# Altium schematic sheet Prometheus.SchDoc: Prometheus
size Letter; Author: Nicholas Sorensen, Tharun Suresh, Erik Halliwell, Stefan Damkjar, and Duncan Elliott; CompanyName: AlbertaSat; Organization: Altium Limited; Revision: 4.1; SheetNumber: 1; SheetTotal: 4; CopyrightYear: 2019
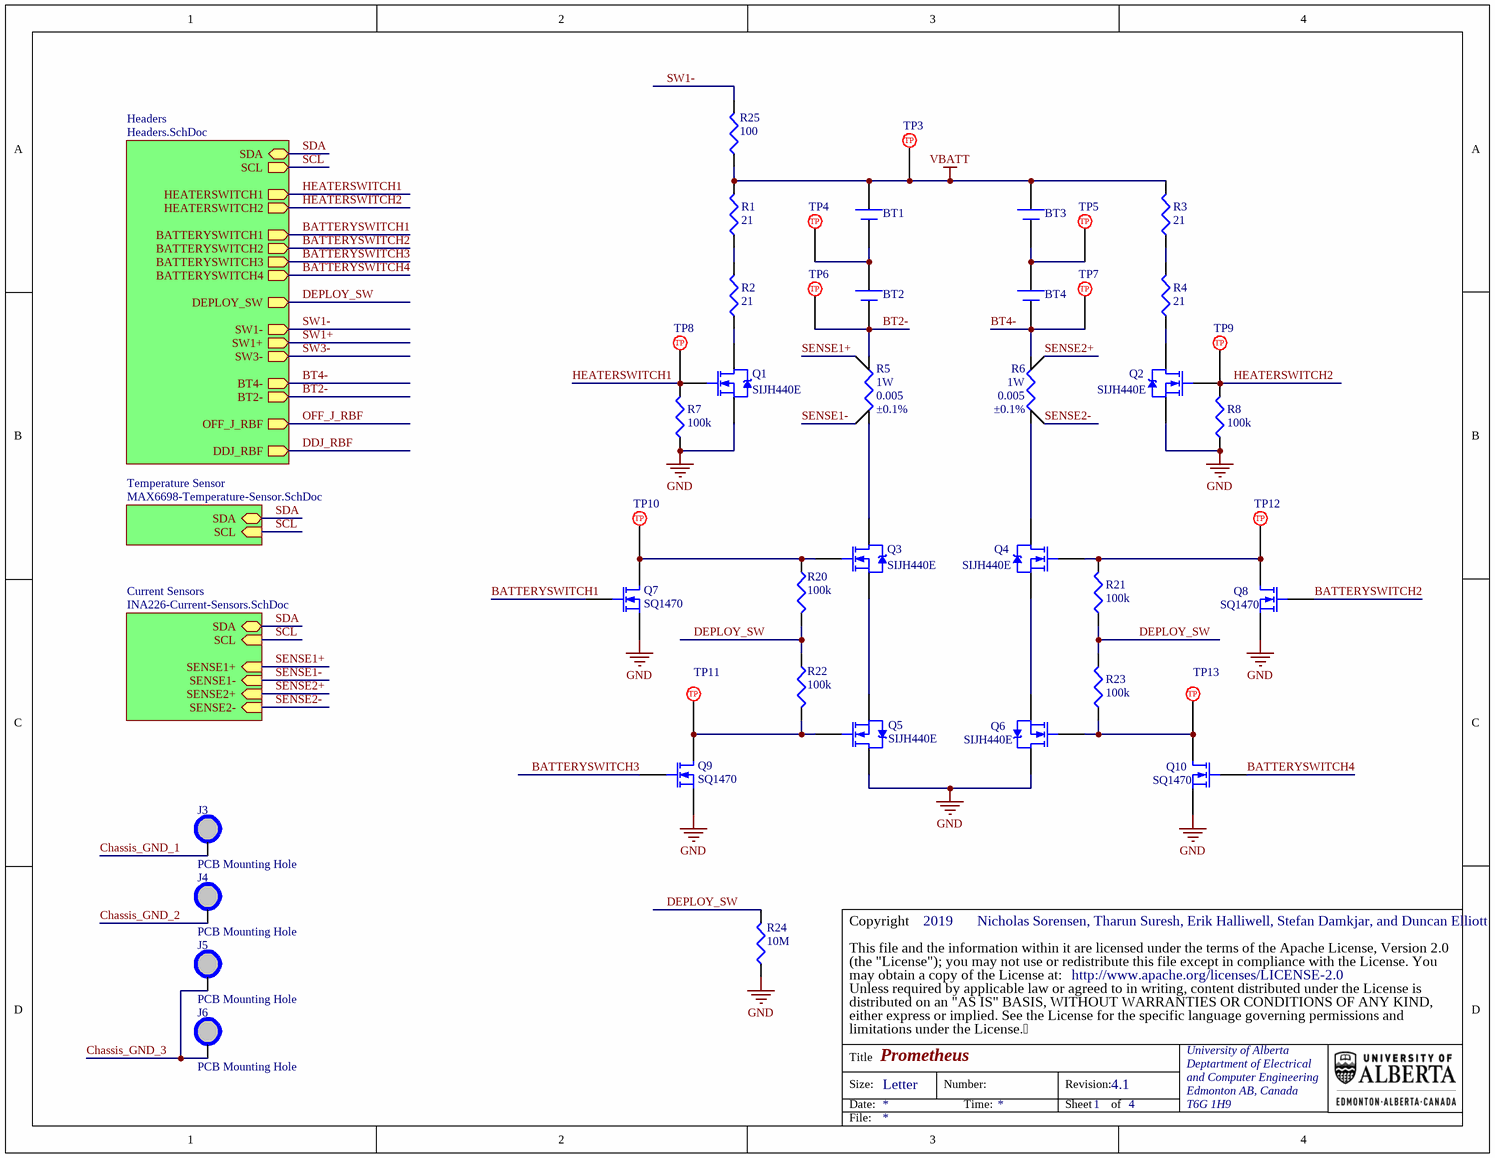
[diagram p0: Prometheus.SchDoc]

## Parts
BT1  NCR18650PF  [ORB-PROTECTED18650]  (value not drawn)
BT2  NCR18650PF  [ORB-PROTECTED18650]  (value not drawn)
BT3  NCR18650PF  [ORB-PROTECTED18650]  (value not drawn)
BT4  NCR18650PF  [ORB-PROTECTED18650]  (value not drawn)
J3  PCB Mounting Hole  [PCB Mounting Hole]
J4  PCB Mounting Hole  [PCB Mounting Hole]
J5  PCB Mounting Hole  [PCB Mounting Hole]
J6  PCB Mounting Hole  [PCB Mounting Hole]
Q1  SIJH440E  [VSH-POWERPAK8X8L]
Q2  SIJH440E  [VSH-POWERPAK8X8L]
Q3  SIJH440E  [VSH-POWERPAK8X8L]
Q4  SIJH440E  [VSH-POWERPAK8X8L]
Q5  SIJH440E  [VSH-POWERPAK8X8L]
Q6  SIJH440E  [VSH-POWERPAK8X8L]
Q7  SQ1470  [VSH-SQ1470AEH]
Q8  SQ1470  [VSH-SQ1470AEH]
Q9  SQ1470  [VSH-SQ1470AEH]
Q10  SQ1470  [VSH-SQ1470AEH]
R1  value 21  [VSH-CPF1]  (hidden comment: Res3)
R2  value 21  [VSH-CPF1]  (hidden comment: Res3)
R3  value 21  [VSH-CPF1]  (hidden comment: Res3)
R4  value 21  [VSH-CPF1]  (hidden comment: Res3)
R5  value 0.005  Power - Rated: 1W  Tolerance: ±0.1%  [VSH-2512R4B]  (hidden comment: Res Sense)
R6  value 0.005  Power - Rated: 1W  Tolerance: ±0.1%  [VSH-2512R4B]  (hidden comment: Res Sense)
R7  value 100k  [PANA-ERJ6EN]  (hidden comment: Res3)
R8  value 100k  [PANA-ERJ6EN]  (hidden comment: Res3)
R20  value 100k  [PANA-ERJ6EN]  (hidden comment: Res3)
R21  value 100k  [PANA-ERJ6EN]  (hidden comment: Res3)
R22  value 100k  [PANA-ERJ6EN]  (hidden comment: Res3)
R23  value 100k  [PANA-ERJ6EN]  (hidden comment: Res3)
R24  value 10M  [VSH-0603MCT]  (hidden comment: Res3)
R25  value 100  [VSH-0805MCU]  (hidden comment: Res3)
TP3  5017  [KS-5017]  (value not drawn)
TP4  5017  [KS-5017]  (value not drawn)
TP5  5017  [KS-5017]  (value not drawn)
TP6  5017  [KS-5017]  (value not drawn)
TP7  5017  [KS-5017]  (value not drawn)
TP8  5017  [KS-5017]  (value not drawn)
TP9  5017  [KS-5017]  (value not drawn)
TP10  5017  [KS-5017]  (value not drawn)
TP11  5017  [KS-5017]  (value not drawn)
TP12  5017  [KS-5017]  (value not drawn)
TP13  5017  [KS-5017]  (value not drawn)

## Sub-sheets
Current Sensors = INA226-Current-Sensors.SchDoc: SCL (in), SDA (bidir), SENSE2+ (in), SENSE2- (in), SENSE1- (in), SENSE1+ (in)
Headers = Headers.SchDoc: SCL (out), SDA (bidir), HEATERSWITCH1 (out), HEATERSWITCH2 (out), BATTERYSWITCH1 (out), BATTERYSWITCH2 (out), DEPLOY_SW (out), BATTERYSWITCH4 (out), BATTERYSWITCH3 (out), SW1- (out), BT4- (out), BT2- (out), OFF_J_RBF (out), DDJ_RBF (out), SW1+ (out), SW3- (out)
Temperature Sensor = MAX6698-Temperature-Sensor.SchDoc: SDA (bidir), SCL (in)

## Nets
GND: Q1.3(S) Q2.3(S) Q5.2(D) Q6.2(D) Q7.3 Q8.3 Q9.3 Q10.3 R7.1 R8.1 R24.1
VBATT: BT1.1(+) BT3.1(+) R1.2 R3.2 R25.1 TP3.1
BATTERYSWITCH1: Q7.2 ; sheet Headers/BATTERYSWITCH1
BATTERYSWITCH2: Q8.2 ; sheet Headers/BATTERYSWITCH2
BATTERYSWITCH3: Q9.2 ; sheet Headers/BATTERYSWITCH3
BATTERYSWITCH4: Q10.2 ; sheet Headers/BATTERYSWITCH4
BT2-: BT2.2(-) R5.2(I2) TP6.1 ; sheet Headers/BT2-
BT4-: BT4.2(-) R6.1(I1) TP7.1 ; sheet Headers/BT4-
Chassis_GND_1: J3.1
Chassis_GND_2: J4.1
Chassis_GND_3: J5.1 J6.1
DDJ_RBF: sheet Headers/DDJ_RBF
DEPLOY_SW: R20.2 R21.1 R22.1 R23.2 R24.2 ; sheet Headers/DEPLOY_SW
HEATERSWITCH1: Q1.1(G) R7.2 TP8.1 ; sheet Headers/HEATERSWITCH1
HEATERSWITCH2: Q2.1(G) R8.2 TP9.1 ; sheet Headers/HEATERSWITCH2
OFF_J_RBF: sheet Headers/OFF_J_RBF
SCL: sheet Temperature Sensor/SCL, sheet Current Sensors/SCL, sheet Headers/SCL
SDA: sheet Temperature Sensor/SDA, sheet Current Sensors/SDA, sheet Headers/SDA
SENSE1+: R5.3(S2) ; sheet Current Sensors/SENSE1+
SENSE1-: R5.4(S1) ; sheet Current Sensors/SENSE1-
SENSE2+: R6.4(S1) ; sheet Current Sensors/SENSE2+
SENSE2-: R6.3(S2) ; sheet Current Sensors/SENSE2-
SW1+: sheet Headers/SW1+
SW1-: R25.2 ; sheet Headers/SW1-
SW3-: sheet Headers/SW3-
NetBT1_2: BT1.2(-) BT2.1(+) TP4.1
NetBT3_2: BT3.2(-) BT4.1(+) TP5.1
NetQ1_2: Q1.2(D) R2.1
NetQ2_2: Q2.2(D) R4.1
NetQ3_1: Q3.1(G) Q7.1 R20.1 TP10.1
NetQ3_2: Q3.2(D) R5.1(I1)
NetQ3_3: Q3.3(S) Q5.3(S)
NetQ4_1: Q4.1(G) Q8.1 R21.2 TP12.1
NetQ4_2: Q4.2(D) R6.2(I2)
NetQ4_3: Q4.3(S) Q6.3(S)
NetQ5_1: Q5.1(G) Q9.1 R22.2 TP11.1
NetQ6_1: Q6.1(G) Q10.1 R23.1 TP13.1
NetR1_1: R1.1 R2.2
NetR3_1: R3.1 R4.2

## Notes on the sheet
- (the "License"); you may not use or redistribute this file except in compliance with the License. You
- This file and the information within it are licensed under the terms of the Apache License, Version 2.0
- Copyright
- Unless required by applicable law or agreed to in writing, content distributed under the License is
- distributed on an "AS IS" BASIS, WITHOUT WARRANTIES OR CONDITIONS OF ANY KIND,
- either express or implied. See the License for the specific language governing permissions and
- limitations under the License.
- may obtain a copy of the License at:
- http://www.apache.org/licenses/LICENSE-2.0
- Title
- Size:
- Date:
- Letter
- Number:
- Time:
- Revision:
- Sheet
- of
- University of Alberta
- Deptartment of Electrical
- and Computer Engineering
- Edmonton AB, Canada
- T6G 1H9
- File:
- (in symbol PTP-KS-00001) TP

## Library data of the parts
BT1-BT4 = PBT-ORB-00001: 18650 Battery-Panasonic Protected 2900mAh NCR18650PF Li-ion inside-10 Amp Dual Protection; Index: 1; Designator: BT?; Battery Cell Size: 18650 Protected; Capacity: 2.9Ah; Voltage - Rated: 3.6V; Part Number: PBT-ORB-00001; Manufacturer Part Number: BRB-2900; Supplier Part Number 1: BRB-2900; Supplier 1: Orbtronic; Publisher: AlbertaSat; Published: 5/24/2019; LatestRevisionDate: 5/24/2019; LatestRevisionNote: ...; Supplier Link: #https://www.orbtronic.com/batteries-chargers/protected-panasonic-18650-li-ion-battery-cell-ncr18650-protection-made-in-japan-top-button#
Q1-Q6 = PQ-VSH-00270: NMOS-2; Manufacturer Part Number: SIJH440E-T1-GE3; Note: Pin 2 is electrically connected to pin 4.; Index: 270; Designator: Q?; Published: 2019-05-24; LatestRevisionDate: 2019-05-24; LatestRevisionNote: ...; DatasheetVersion: PD-9.814; PackageVersion: Feb-1997; PackageReference: VSH-POWERPAK8X8L; Publisher: AlbertaSat; PackageDescription: TO, Thru-Hole, Vertical, Heatsink Mounted; 3 In-Line Leads; Pitch 2.54 mm; ComponentLink1Description: Manufacturer Link; ComponentLink1URL: http://www.irf.com/; Part Number: PQ-VSH-00270; Supplier Part Number 1: SIJH440E-T1-GE3CT-ND; Supplier 1: Digi-key; Supplier Part Number 2: 78-SIJH440E-T1-GE3; Supplier 2: Mouser; Supplier Link: #https://www.digikey.ca/product-detail/en/vishay-siliconix/SIJH440E-T1-GE3/SIJH440E-T1-GE3CT-ND/6709032#
Q7-Q10 = PQ-VSH-00227: MOSFET N-CH 30V 2.8A SC70; Manufacturer Part Number: SQ1470AEH-T1_GE3; Index: 227; Designator: Q?; Published: 7/12/2017; LatestRevisionDate: 7/12/2017; LatestRevisionNote: ...; PackageVersion: 1995/1996; PackageReference: VSH-SOT363; Publisher: AlbertaSat; PackageDescription: SOT23, 6-Leads, Body 2.00x2.10mm, Pitch 0.65mm, IPC Low Density; Part Number: PQ-VSH-00227; Supplier Part Number 1: SQ1470AEH-T1_GE3CT-ND; Supplier 1: Digi-key; Supplier Part Number 2: 78-SQ1470AEH-T1_GE3; Supplier 2: Mouser; Supplier Link: #https://www.digikey.ca/product-detail/en/vishay-siliconix/SQ1470AEH-T1_GE3/SQ1470AEH-T1_GE3CT-ND/6595360#; Applications: Automotive
R1-R4 = PR-VSH-00269: 21 Ohms ±1% 1W Through Hole Resistor Axial Flame Proof, Moisture Resistant, Safety Metal Film; Manufacturer Part Number: CPF121R000FKEE6; Index: 269; Designator: R?; Temperature Coefficient: ±100ppm/°C; Published: 3/27/2019; LatestRevisionDate: 3/27/2019; LatestRevisionNote: ...; PackageReference: VSH-CPF1; Publisher: AlbertaSat; PackageDescription: RESISTOR METAL FILM 1W 21.0 OHM; Part Number: PR-VSH-00269; Supplier Part Number 1: CPF21.0CCT-ND; Supplier 1: Digi-key; Supplier Link: https://www.digikey.ca/products/en/resistors/through-hole-resistors/53?k=cpf1&k=&pkeyword=cpf1&sv=0&pv1989=0&pv2085=u21+Ohms&sf=0&FV=ffe00035&quantity=&ColumnSort=0&page=1&stock=1&pageSize=25; Tolerance: ±1%; Power - Rated: 1W; Applications: Automotive
R5 R6 = PR-VSH-00234: RES SMD 0.005 OHM 0.1% 1W 2512; Manufacturer Part Number: Y14870R00500B9R; Index: 234; Designator: R?; Temperature Coefficient: ±15ppm/°C; Part Number: PR-VSH-00234; Supplier Part Number 1: 804-1043-1-ND; Supplier 1: Digi-key; Supplier Part Number 2: 71-CSM25120R0050BST; Supplier 2: Mouser; Publisher: AlbertaSat; Published: 2017-07-12; LatestRevisionDate: 2017-07-12; LatestRevisionNote: ...; PackageReference: VSH-2512R4B; Supplier Link: http://www.digikey.ca/product-search/en?keywords=804-1043-1-ND; Applications: Automotive
R7 R8 R20-R23 = 18749: RES SMD 100K OHM 1% 1/8W 0805; Part Number: 18749; Manufacturer Part Number: ERJ-6ENF1003V; Designator: R?; Power: 0.125W, 1/8W; Temperature Coefficient: ±100ppm/°C; Published: 8-Jun-2000; LatestRevisionDate: 29-May-2009; LatestRevisionNote: IPC-7351 Footprint Added.; PackageReference: 0805 (2012 Metric); Publisher: Altium Limited; PackageDescription: Chip Resistor, 2-Leads, Body 2.00x1.25mm, IPC Low Density; Supplier Part Number 1: P100KCCT-ND; Supplier 1: Digi-Key; Supplier Link: http://www.digikey.ca/product-search/en?keywords=P100KCCT-ND; Tolerance: ±1%
R24 = PR-VSH-00224: RES SMD 10M OHM 1% 1/8W 0603; Manufacturer Part Number: MCT06030C1005FP500; Index: 224; Designator: R?; Temperature Coefficient: ±50ppm/°C; Published: 3/14/2016; LatestRevisionDate: 3/14/2016; LatestRevisionNote: ...; PackageReference: 0603 (1608 Metric); Publisher: AlbertaSat; PackageDescription: Chip Resistor, 2-Leads, Body 1.55x0.85mm, IPC Low Density; Part Number: PR-VSH-00224; Supplier Part Number 1: MCT0603-10.0M-CFCT-ND; Supplier 1: Digi-key; Supplier Link: http://www.digikey.ca/product-search/en?keywords=MCT0603-10.0M-CFCT-ND; Tolerance: ±1%; Power - Rated: 1/8W; Applications: General Purpose
R25 = PR-VSH-00029: RES SMD 100 OHM 1% 1/5W 0805; Manufacturer Part Number: MCU08050C1000FP500; Index: 29; Designator: R?; Temperature Coefficient: ±50ppm/°C; Published: 3/14/2016; LatestRevisionDate: 3/14/2016; LatestRevisionNote: ...; PackageReference: 0805 (2012 Metric); Publisher: AlbertaSat; PackageDescription: Chip Resistor, 2-Leads, Body 2.00x1.25mm, IPC Low Density; Part Number: PR-VSH-00029; Supplier Part Number 1: MCU0805-100-CFCT-ND; Supplier 1: Digi-key; Supplier Link: http://www.digikey.ca/product-search/en?keywords=MCU0805-100-CFCT-ND; Tolerance: ±1%; Power - Rated: 1/5W; Applications: General Purpose
TP3-TP9 TP11-TP13 = PTP-KS-00001: PC TEST POINT MINI SMD; Index: 1; Supplier 1: Digi-key; Supplier 2: Newark; Supplier 3: Mouser; Part Number: PTP-KS-00001; Manufacturer Part Number: 5017; Supplier Part Number 1: 36-5017CT-ND; Publisher: AlbertaSat; Published: 3/15/2016; LatestRevisionDate: 3/15/2016; LatestRevisionNote: ...; PackageReference: KS-5017; PackageDescription: Testpoint Lug Mini SMD 27X10X152; Supplier Link: http://www.digikey.ca/product-detail/en/keystone-electronics/5017/36-5017TR-ND/2217304
TP10 = PTP-KS-00001: 3; Index: 1; Supplier 1: Digi-key; Supplier 2: Newark; Supplier 3: Mouser; Part Number: PTP-KS-00001; Manufacturer Part Number: 5017; Supplier Part Number 1: 36-5017CT-ND; Publisher: AlbertaSat; Published: 3/15/2016; LatestRevisionDate: 3/15/2016; LatestRevisionNote: ...; PackageReference: KS-5017; PackageDescription: Testpoint Lug Mini SMD 27X10X152; Supplier Link: http://www.digikey.ca/product-detail/en/keystone-electronics/5017/36-5017TR-ND/2217304